# Altium schematic sheet protel_wireless_remote.SchDoc
size A4
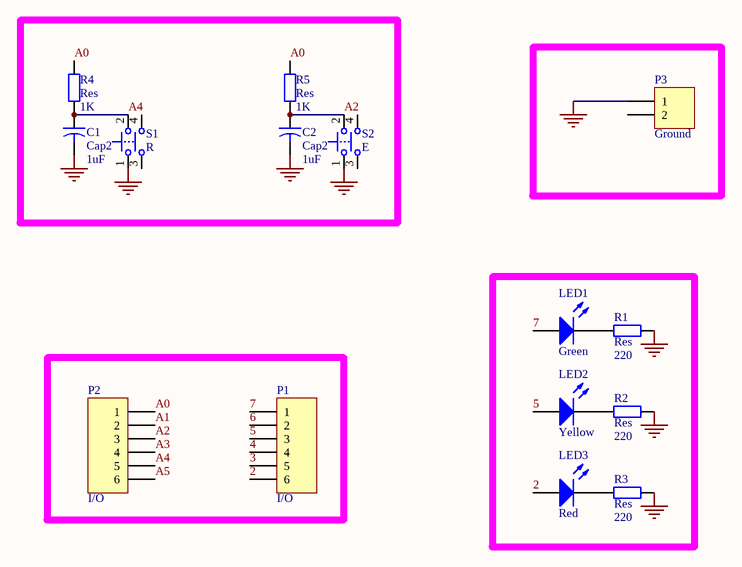
[diagram p0: protel_wireless_remote.SchDoc]

## Parts
C1  Cap2  value 1uF  [CAPR5-4X5]
C2  Cap2  value 1uF  [CAPR5-4X5]
LED1  Green  [LED-1]
LED2  Yellow  [LED-1]
LED3  Red  [LED-1]
P1  I/O  [HDR1X6]
P2  I/O  [HDR1X6]
P3  Ground  [HDR1X2]
R1  Res  value 220  [AXIAL-0.4]
R2  Res  value 220  [AXIAL-0.4]
R3  Res  value 220  [AXIAL-0.4]
R4  Res  value 1K  [AXIAL-0.4]
R5  Res  value 1K  [AXIAL-0.4]
S1  R  [IT-2175]
S2  E  [IT-2175]

## Nets
GND: C1.2 C2.2 P3.1 R1.2 R2.2 R3.2 S1.1 S2.1
2: LED3.1(A) P1.6
3: P1.5
4: P1.4
5: LED2.1(A) P1.3
6: P1.2
7: LED1.1(A) P1.1
A0: P2.1 R4.2 R5.2
A1: P2.2
A2: C2.1 P2.3 R5.1 S2.2
A3: P2.4
A4: C1.1 P2.5 R4.1 S1.2
A5: P2.6
NetLED1_2: LED1.2(K) R1.1
NetLED2_2: LED2.2(K) R2.1
NetLED3_2: LED3.2(K) R3.1

Not connected (* = marked no-connect by the designer): P3 2; S1 3 4; S2 3 4

## Library data of the parts
C1 C2 = Cap2: Capacitor; Published: 23-Sep-2002; Publisher: Altium Limited
LED1-LED3 = LED1: Typical RED GaAs LED; Published: 8-Jun-2000; LatestRevisionDate: 17-Jul-2002; LatestRevisionNote: Re-released for DXP Platform.; Publisher: Altium Limited
P1 P2 = Header 6: Header, 6-Pin; LatestRevisionDate: 17-Jul-2002; LatestRevisionNote: Re-released for DXP Platform.; Publisher: Altium Limited
P3 = Header 2: Header, 2-Pin; LatestRevisionDate: 17-Jul-2002; LatestRevisionNote: Re-released for DXP Platform.; Publisher: Altium Limited
R1-R5 = Res2: Resistor; Published: 8-Jun-2000; LatestRevisionDate: 17-Jul-2002; LatestRevisionNote: Re-released for DXP Platform.; Publisher: Altium Limited
S1 S2 = IT-2175: Tactile Switch, DPST; Thru-Hole; Vertical; Rating DC 12V, 50mA (max); PackageDocument: Rev.0; Published: 6-Jun-2005; DatasheetDocument: Rev.0; PackageReference: IT-2175; Publisher: Altium Limited; ComponentLink1Description: Manufacturer Link; ComponentLink1URL: http://www.ilswitch.com/; ComponentLink2Description: Device Overview; ComponentLink2URL: http://www.ilswitch.com/list.php?ac_id=010112&ai_id=91